# Altium schematic sheet AUDIO_JACK.SchDoc
size A3; SheetNumber: 1; SheetTotal: 22
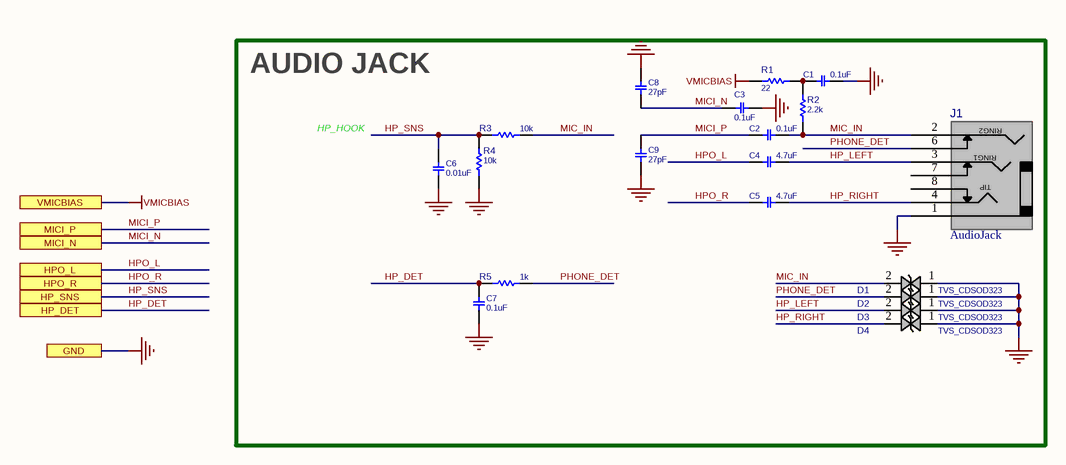
[diagram p0: AUDIO_JACK.SchDoc]

## Parts
C1  0.1uF  [C0402]
C2  0.1uF  [C0402]
C3  0.1uF  [C0402]
C4  4.7uF  [C0402]
C5  4.7uF  [C0402]
C6  0.01uF  [C0402]
C7  0.1uF  [C0402]
C8  27pF  [C0402]
C9  27pF  [C0402]
D1  TVS_CDSOD323  [D0805]
D2  TVS_CDSOD323  [D0805]
D3  TVS_CDSOD323  [D0805]
D4  TVS_CDSOD323  [D0805]
J1  AudioJack  [JCKAS_PJ340]
R1  22  [R0402]
R2  2.2k  [R0402]
R3  10k  [R0402]
R4  10k  [R0402]
R5  1k  [R0402]

## Ports
GND, HP_DET, HP_SNS, HPO_L, HPO_R, MICI_N, MICI_P, VMICBIAS

## Nets
GND: C1.1 C3.1 C6.1 C7.2 C8.1 C9.2 D1.1 D2.1 D3.1 D4.1 J1.1(SLEEVE) R4.2 ; port GND
VMICBIAS: R1.1 ; port VMICBIAS
HP_DET: C7.1 R5.1 ; port HP_DET
HP_LEFT: C4.2 D3.2 J1.3(RING1)
HP_RIGHT: C5.2 D4.2 J1.4(TIP)
HP_SNS: C6.2 R3.1 R4.1 ; port HP_SNS
HPO_L: C4.1 ; port HPO_L
HPO_R: C5.1 ; port HPO_R
MIC_IN: C2.2 D1.2 J1.2(RING2) R2.2 R3.2
MICI_N: C3.2 C8.2 ; port MICI_N
MICI_P: C2.1 C9.1 ; port MICI_P
PHONE_DET: D2.2 J1.6(RING2SW) R5.2
NetC1_2: C1.2 R1.2 R2.1

Not connected (* = marked no-connect by the designer): J1 7(RING1SW) 8(TIPSW)

## Notes on the sheet
- AUDIO JACK
- HP_HOOK

## Library data of the parts
C1-C3 C7 = CAP_SMD_MLCC: CAP, MLCC; PARAM: X5R, 10%; MANF_P#: GRM155R61E104; MANF: Murata; PARAM2: 25v; PRICE: 10,000:	$0.006; ASSEMBLY: ASSEMBLY; VALUE: 0.1uF
C4 C5 = CAP_SMD_MLCC_100n50TDK: CAP, MLCC; PARAM: X5R, 20%; MANF_P#: CL05A475MP5NRNC; MANF: Samsung; PARAM2: 10v; ASSEMBLY: ASSEMBLY; PRICE: 10,000: $0.034; VALUE: 4.7uF
C6 = CAP_SMD_MLCC: CAP, MLCC; PARAM: X5R, 10%; PARAM2: 25v; PRICE: 10,000:	$0.006; MANF_P#: -; MANF: -; ASSEMBLY: ASSEMBLY; VALUE: 0.01uF
C8 C9 = CAP_SMD_MLCC: CAP, MLCC; PARAM: X5R, 10%; MANF_P#: CC0402JRNPO9BN270; MANF: Yageo; PARAM2: 10v; PRICE: 10,000: $0.034; ASSEMBLY: ASSEMBLY; VALUE: 27pF
D1-D4 = TVS_CDSOD323: TVS, ESD PROTECT, Bidirectional; MANF_P#: CDSOD323-T12C; MANF: Bourns; PARAM2: 13.3VB, 12VR; PRICE: 0.7$; VALUE: TVS_CDSOD323
J1 = JACKA3.5SMD_PJ-340-SMD: Jack, Audio, Stereo, 3.5mm, RA, THD; MANF: xyfwcn; MANF_P#: PJ-340-SMD; PRICE: 0.5$; VALUE: AudioJack
R1-R5 = RES_SMD: RESISTOR, SMD; PARAM: 0.063W; DESC: DESCRIPTION; DIST#: MOUSER; PARAM2: 1%; MANF_P#: -; MANF: -; ASSEMBLY: ASSEMBLY; PRICE: 100= 0.3$
  R1: VALUE: 22
  R2: VALUE: 2.2k
  R3 R4: VALUE: 10k
  R5: VALUE: 1k